# EAGLE schematic Microduino-SIM800H 20140112 (EAGLE 6.3)
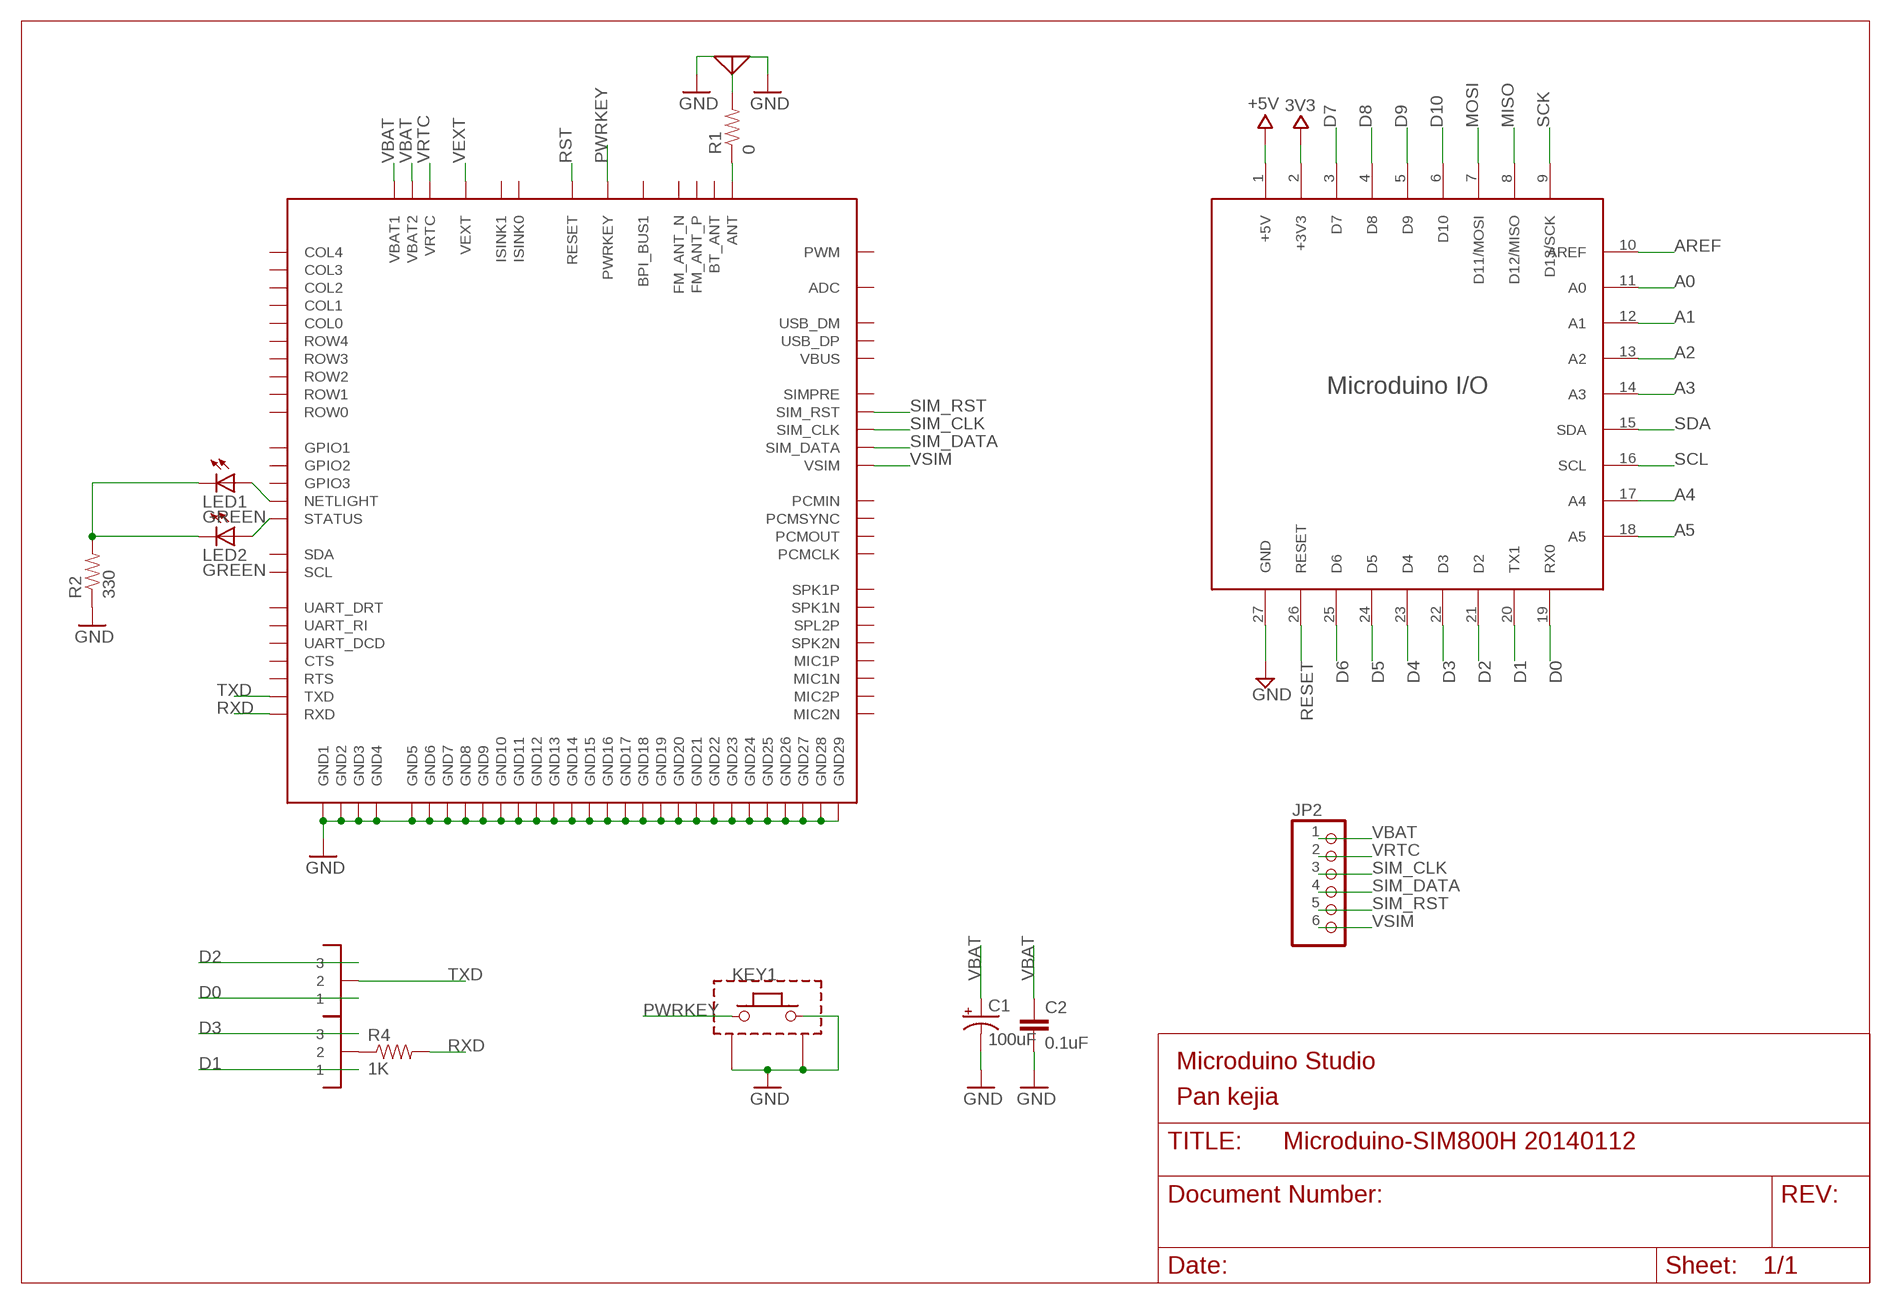
[diagram p0: schematic, sheet 1]

## Parts
C1  100uF  CAP_POL3528  [EIA3528]
C2  0.1uF  CAP0603-CAP  [0603-CAP]
JP2  PINHD-1X6  [1X06]
KEY1  KEY-TES-018  [LX-1100B]
LED1  GREEN  LED0805  [0805-LED]
LED2  GREEN  LED0805  [0805-LED]
R1  0  RESISTOR0402-RES  [0402-RES]
R2  330  RESISTOR0603-RES  [0603-RES]
R4  1K  RESISTOR0603-RES  [0603-RES]
U$1  MICRDUINO-PIN/NORMAL  [27UPIN-NORMAL]
U$2  SIM800H  [SIM800]
U$5  ANT-IPEX  [IPEX]
U$6  JUMPER1-2  [JUMPER1-2]
U$7  JUMPER1-2  [JUMPER1-2]

## Nets
3V3: U$1.2(+3V3)
+5V: U$1.1(+5V)
A0: U$1.11(A0)
A1: U$1.12(A1)
A2: U$1.13(A2)
A3: U$1.14(A3)
A4: U$1.17(A4)
A5: U$1.18(A5)
AREF: U$1.10(AREF)
D0: U$1.19(RX0) U$6.1
D1: U$1.20(TX1) U$7.1
D2: U$1.21(D2) U$6.3
D3: U$1.22(D3) U$7.3
D4: U$1.23(D4)
D5: U$1.24(D5)
D6: U$1.25(D6)
D7: U$1.3(D7)
D8: U$1.4(D8)
D9: U$1.5(D9)
D10: U$1.6(D10)
GND: C1.C(-) C2.2 KEY1.1 KEY1.3 KEY1.4 R2.1 U$1.27(GND) U$2.P$2(GND1) U$2.P$6(GND10) U$2.P$8(GND11) U$2.P$35(GND5) U$2.P$37(GND6) U$2.P$38(GND7) U$2.P$39(GND8) U$2.P$41(GND12) U$2.P$43(GND2) U$2.P$44(GND3) U$2.P$45(GND4) U$2.P$58(GND9) U$2.P$67(GND13) U$2.P$71(GND14) U$2.P$72(GND15) U$2.P$73(GND16) U$2.P$76(GND17) U$2.P$77(GND18) U$2.P$78(GND19) U$2.P$79(GND20) U$2.P$80(GND21) U$2.P$81(GND22) U$2.P$82(GND23) U$2.P$83(GND24) U$2.P$84(GND25) U$2.P$85(GND26) U$2.P$86(GND27) U$2.P$87(GND28) U$2.P$88(GND29) U$5.1(GND1) U$5.2(GND2)
MISO: U$1.8(D12/MISO)
MOSI: U$1.7(D11/MOSI)
N$1: R1.2 U$5.3(ANT)
N$2: R1.1 U$2.P$40(ANT)
N$3: R4.1 U$7.2
N$4: LED1.C LED2.C R2.2
N$6: LED2.A U$2.P$4(STATUS)
NETLIGHT: LED1.A U$2.P$64(NETLIGHT)
PWRKEY: KEY1.2 U$2.P$48(PWRKEY)
RESET: U$1.26(RESET)
RST: U$2.P$49(RESET)
RXD: R4.2 U$2.P$31(RXD)
SCK: U$1.9(D13/SCK)
SCL: U$1.16(SCL)
SDA: U$1.15(SDA)
SIM_CLK: JP2.3 U$2.P$55(SIM_CLK)
SIM_DATA: JP2.4 U$2.P$14(SIM_DATA)
SIM_RST: JP2.5 U$2.P$15(SIM_RST)
TXD: U$2.P$32(TXD) U$6.2
VBAT: C1.A(+) C2.1 JP2.1 U$2.P$1(VBAT1) U$2.P$42(VBAT2)
VEXT: U$2.P$18(VEXT)
VRTC: JP2.2 U$2.P$56(VRTC)
VSIM: JP2.6 U$2.P$16(VSIM)
Unconnected: U$2.P$3(GPIO1) U$2.P$5(BPI_BUS1) U$2.P$7(VBUS) U$2.P$9(MIC2P) U$2.P$10(MIC2N) U$2.P$11(SPK2N) U$2.P$12(MIC1N) U$2.P$13(SPK1N) U$2.P$17(FM_ANT_P) U$2.P$19(USB_DM) U$2.P$20(COL0) U$2.P$21(COL3) U$2.P$22(COL2) U$2.P$23(ROW3) U$2.P$24(COL4) U$2.P$25(COL1) U$2.P$26(PWM) U$2.P$27(GPIO2) U$2.P$28(GPIO3) U$2.P$29(PCMCLK) U$2.P$30(PCMOUT) U$2.P$33(RTS) U$2.P$34(CTS) U$2.P$36(BT_ANT) U$2.P$46(ISINK1) U$2.P$47(ISINK0) U$2.P$50(ADC) U$2.P$51(SPL2P) U$2.P$52(MIC1P) U$2.P$53(SPK1P) U$2.P$54(SIMPRE) U$2.P$57(FM_ANT_N) U$2.P$59(USB_DP) U$2.P$60(ROW1) U$2.P$61(ROW2) U$2.P$62(ROW0) U$2.P$63(ROW4) U$2.P$65(PCMSYNC) U$2.P$66(PCMIN) U$2.P$68(UART_RI) U$2.P$69(UART_DRT) U$2.P$70(UART_DCD) U$2.P$74(SCL) U$2.P$75(SDA)

## Notes on the sheet
- Microduino Studio
- Pan kejia

## Library data of the parts
C1 = #_microduino_20131030:CAP_POL: Capacitor Polarized These are standard SMD and PTH capacitors. Normally 10uF, 47uF, and 100uF in electrolytic and tantalum varieties. Always verify the external diameter of the through hole cap, it varies with capacity, voltage, and manufacturer. The EIA devices should be standard.
C2 = #_microduino_20131030:CAP: Capacitor Standard 0603 ceramic capacitor, and 0.1" leaded capacitor.
JP2 = #_microduino_20131030:PINHD-1X6: PIN HEADER
KEY1 = #_microduino_20131030:KEY
LED1 LED2 = #_microduino_20131030:LED: LEDs Standard schematic elements and footprints for 5mm, 3mm, 1206, and 0603 sized LEDs. 5mm - Spark Fun Electronics SKU : COM-00529 (and others)
R1 R2 = #_microduino_20131030:RESISTOR: Resistor Basic schematic elements and footprints for 0603, 1206, and PTH 1/10th watt (small) resistors.
R4 = microduino:RESISTOR: Resistor Basic schematic elements and footprints for 0603, 1206, and PTH 1/10th watt (small) resistors.
U$1 = #_microduino_20131030:MICRDUINO-PIN: microduino引脚封装
U$2 = #_PKJ:SIM800H
U$5 = #_microduino_20131030:ANT-IPEX
U$6 U$7 = #_microduino_20131030:JUMPER1-2

## Net classes
0 default: width 0.254 mm, drill 0.61 mm, clearance 0.254 mm